# Altium schematic sheet Driver.SchDoc
size A4; SheetNumber: 2; SheetTotal: 3
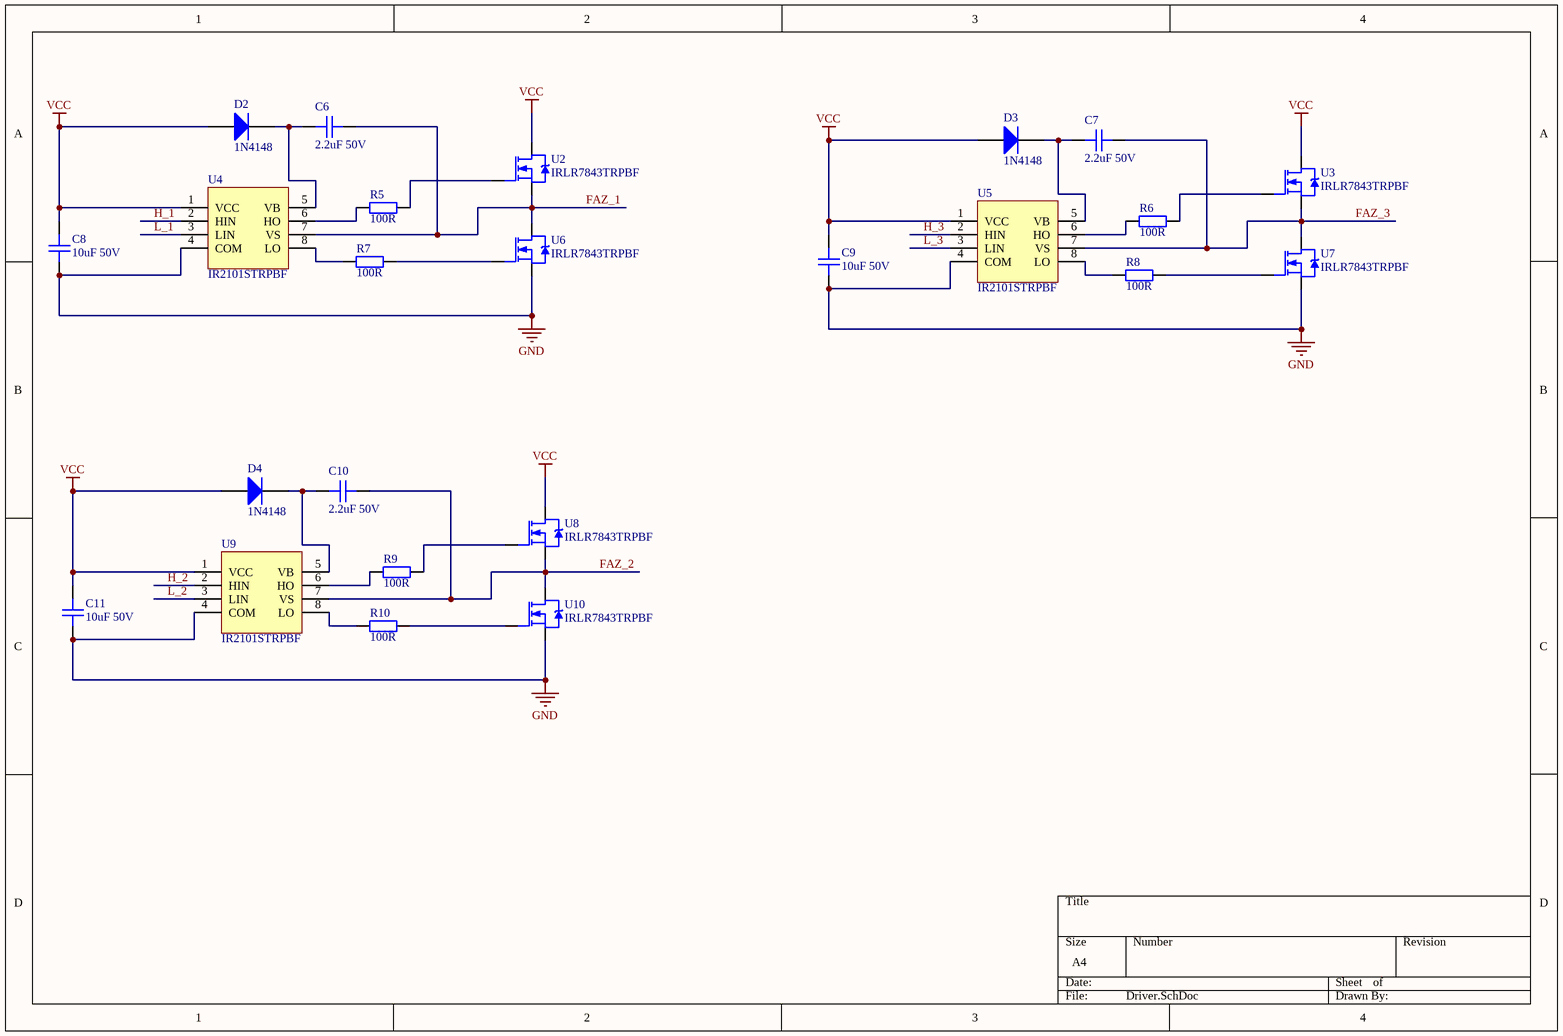
[diagram p0: Driver.SchDoc]

## Parts
C6  Deger: 2.2uF 50V  [CAP 1206/3216]  (hidden comment: CAP CER 2.2UF 50V X5R 1206)
C7  Deger: 2.2uF 50V  [CAP 1206/3216]  (hidden comment: CAP CER 2.2UF 50V X5R 1206)
C8  Deger: 10uF 50V  [CAP 1206/3216]  (hidden comment: CAP CER 10UF 50V X5R 1206)
C9  Deger: 10uF 50V  [CAP 1206/3216]  (hidden comment: CAP CER 10UF 50V X5R 1206)
C10  Deger: 2.2uF 50V  [CAP 1206/3216]  (hidden comment: CAP CER 2.2UF 50V X5R 1206)
C11  Deger: 10uF 50V  [CAP 1206/3216]  (hidden comment: CAP CER 10UF 50V X5R 1206)
D2  1N4148 Diyot  [SOD-123]  (value not drawn)
D3  1N4148 Diyot  [SOD-123]  (value not drawn)
D4  1N4148 Diyot  [SOD-123]  (value not drawn)
R5  Deger: 100R  [RES-0805]  (hidden comment: RES SMD 100 OHM 1% 1/8W 0805)
R6  Deger: 100R  [RES-0805]  (hidden comment: RES SMD 100 OHM 1% 1/8W 0805)
R7  Deger: 100R  [RES-0805]  (hidden comment: RES SMD 100 OHM 1% 1/8W 0805)
R8  Deger: 100R  [RES-0805]  (hidden comment: RES SMD 100 OHM 1% 1/8W 0805)
R9  Deger: 100R  [RES-0805]  (hidden comment: RES SMD 100 OHM 1% 1/8W 0805)
R10  Deger: 100R  [RES-0805]  (hidden comment: RES SMD 100 OHM 1% 1/8W 0805)
U2  Deger: IRLR7843TRPBF  [DPAK]  (hidden comment: MOSFET N-CH 30V 161A DPAK)
U3  Deger: IRLR7843TRPBF  [DPAK]  (hidden comment: MOSFET N-CH 30V 161A DPAK)
U4  deger: IR2101STRPBF  [SOIC8]  (hidden comment: IC GATE DRVR HALF-BRIDGE 8SOIC)
U5  deger: IR2101STRPBF  [SOIC8]  (hidden comment: IC GATE DRVR HALF-BRIDGE 8SOIC)
U6  Deger: IRLR7843TRPBF  [DPAK]  (hidden comment: MOSFET N-CH 30V 161A DPAK)
U7  Deger: IRLR7843TRPBF  [DPAK]  (hidden comment: MOSFET N-CH 30V 161A DPAK)
U8  Deger: IRLR7843TRPBF  [DPAK]  (hidden comment: MOSFET N-CH 30V 161A DPAK)
U9  deger: IR2101STRPBF  [SOIC8]  (hidden comment: IC GATE DRVR HALF-BRIDGE 8SOIC)
U10  Deger: IRLR7843TRPBF  [DPAK]  (hidden comment: MOSFET N-CH 30V 161A DPAK)

## Nets
GND: C8.1 C9.1 C11.1 U4.4(COM) U5.4(COM) U6.3(S) U7.3(S) U9.4(COM) U10.3(S)
VCC: C8.2 C9.2 C11.2 D2.1(A) D3.1(A) D4.1(A) U2.4(D) U3.4(D) U4.1(VCC) U5.1(VCC) U8.4(D) U9.1(VCC)
FAZ_1: C6.2 U2.3(S) U4.7(VS) U6.4(D)
FAZ_2: C10.2 U8.3(S) U9.7(VS) U10.4(D)
FAZ_3: C7.2 U3.3(S) U5.7(VS) U7.4(D)
H_1: U4.2(HIN)
H_2: U9.2(HIN)
H_3: U5.2(HIN)
L_1: U4.3(LIN)
L_2: U9.3(LIN)
L_3: U5.3(LIN)
NetC6_1: C6.1 D2.2(K) U4.5(VB)
NetC7_1: C7.1 D3.2(K) U5.5(VB)
NetC10_1: C10.1 D4.2(K) U9.5(VB)
NetR5_1: R5.1 U4.6(HO)
NetR5_2: R5.2 U2.1(G)
NetR6_1: R6.1 U5.6(HO)
NetR6_2: R6.2 U3.1(G)
NetR7_1: R7.1 U4.8(LO)
NetR7_2: R7.2 U6.1(G)
NetR8_1: R8.1 U5.8(LO)
NetR8_2: R8.2 U7.1(G)
NetR9_1: R9.1 U9.6(HO)
NetR9_2: R9.2 U8.1(G)
NetR10_1: R10.1 U9.8(LO)
NetR10_2: R10.2 U10.1(G)

## Library data of the parts
C6 C7 C10 = 2.2uF 50V 1206: 2.2µF ±10% 50V Ceramic Capacitor X5R 1206 (3216 Metric); Cins: Kondansator; Uretici Kodu: CL31A225KBHNNNE; Kılıf: 1206; -Sicaklik: -55; +Sicaklik: +85; Lehim Yöntemi: SMD; MSL: 1 (Unlimited)
C8 C9 C11 = 10uF 50V 1206: 10µF ±10% 50V Ceramic Capacitor X5R 1206 (3216 Metric); Cins: Kondansator; Uretici Kodu: CL31A106KBHNNNE; Kılıf: 1206; -Sicaklik: -55; +Sicaklik: +125; Lehim Yöntemi: SMD; MSL: 1 (Unlimited)
D2-D4 = 1N4148: DIODE GEN PURP 100V 150MA SOD123; Uretici Kodu: 1N4148W-TP; -Sicaklik: -65; +Sicaklik: +150; Lehim Yöntemi: SMD; Cins: Diyot; Kılıf: SOD123; MSL: 1 (Unlimited); Deger: 1N4148
R5-R10 = 100R 0805: 100 Ohms ±1% 0.125W, 1/8W Chip Resistor 0805 (2012 Metric) Moisture Resistant Thick Film; Cins: Direnc; Uretici Kodu: RC0805FR-07100RL; Kılıf: 0805; -Sicaklik: -55; +Sicaklik: +155; Lehim Yöntemi: SMD; MSL: 1 (Unlimited)
U2 U3 U6-U8 U10 = IRLR7843: N-Channel 30V 161A (Tc) 140W (Tc) Surface Mount D-Pak; Kılıf: DPAK(TO-252-3); -Sicaklik: -55; +Sicaklik: +175; Lehim Yöntemi: SMD; Cins: MOSFET; Uretici Kodu: IRLR7843TRPBF; MSL: 1 (Unlimited)
U4 U5 U9 = IR2101: Half-Bridge Gate Driver IC Non-Inverting 8-SOIC; sıcaklık+: +150; sıcaklık -: -40; lehim yöntemi: SMD; cins: IC; üretici kodu: IR2101STRPBF; kılıf: SOIC8; MSL: 2 (1 Year)